# EAGLE design 214_oled 1_0_11 (EAGLE 9.6.0)
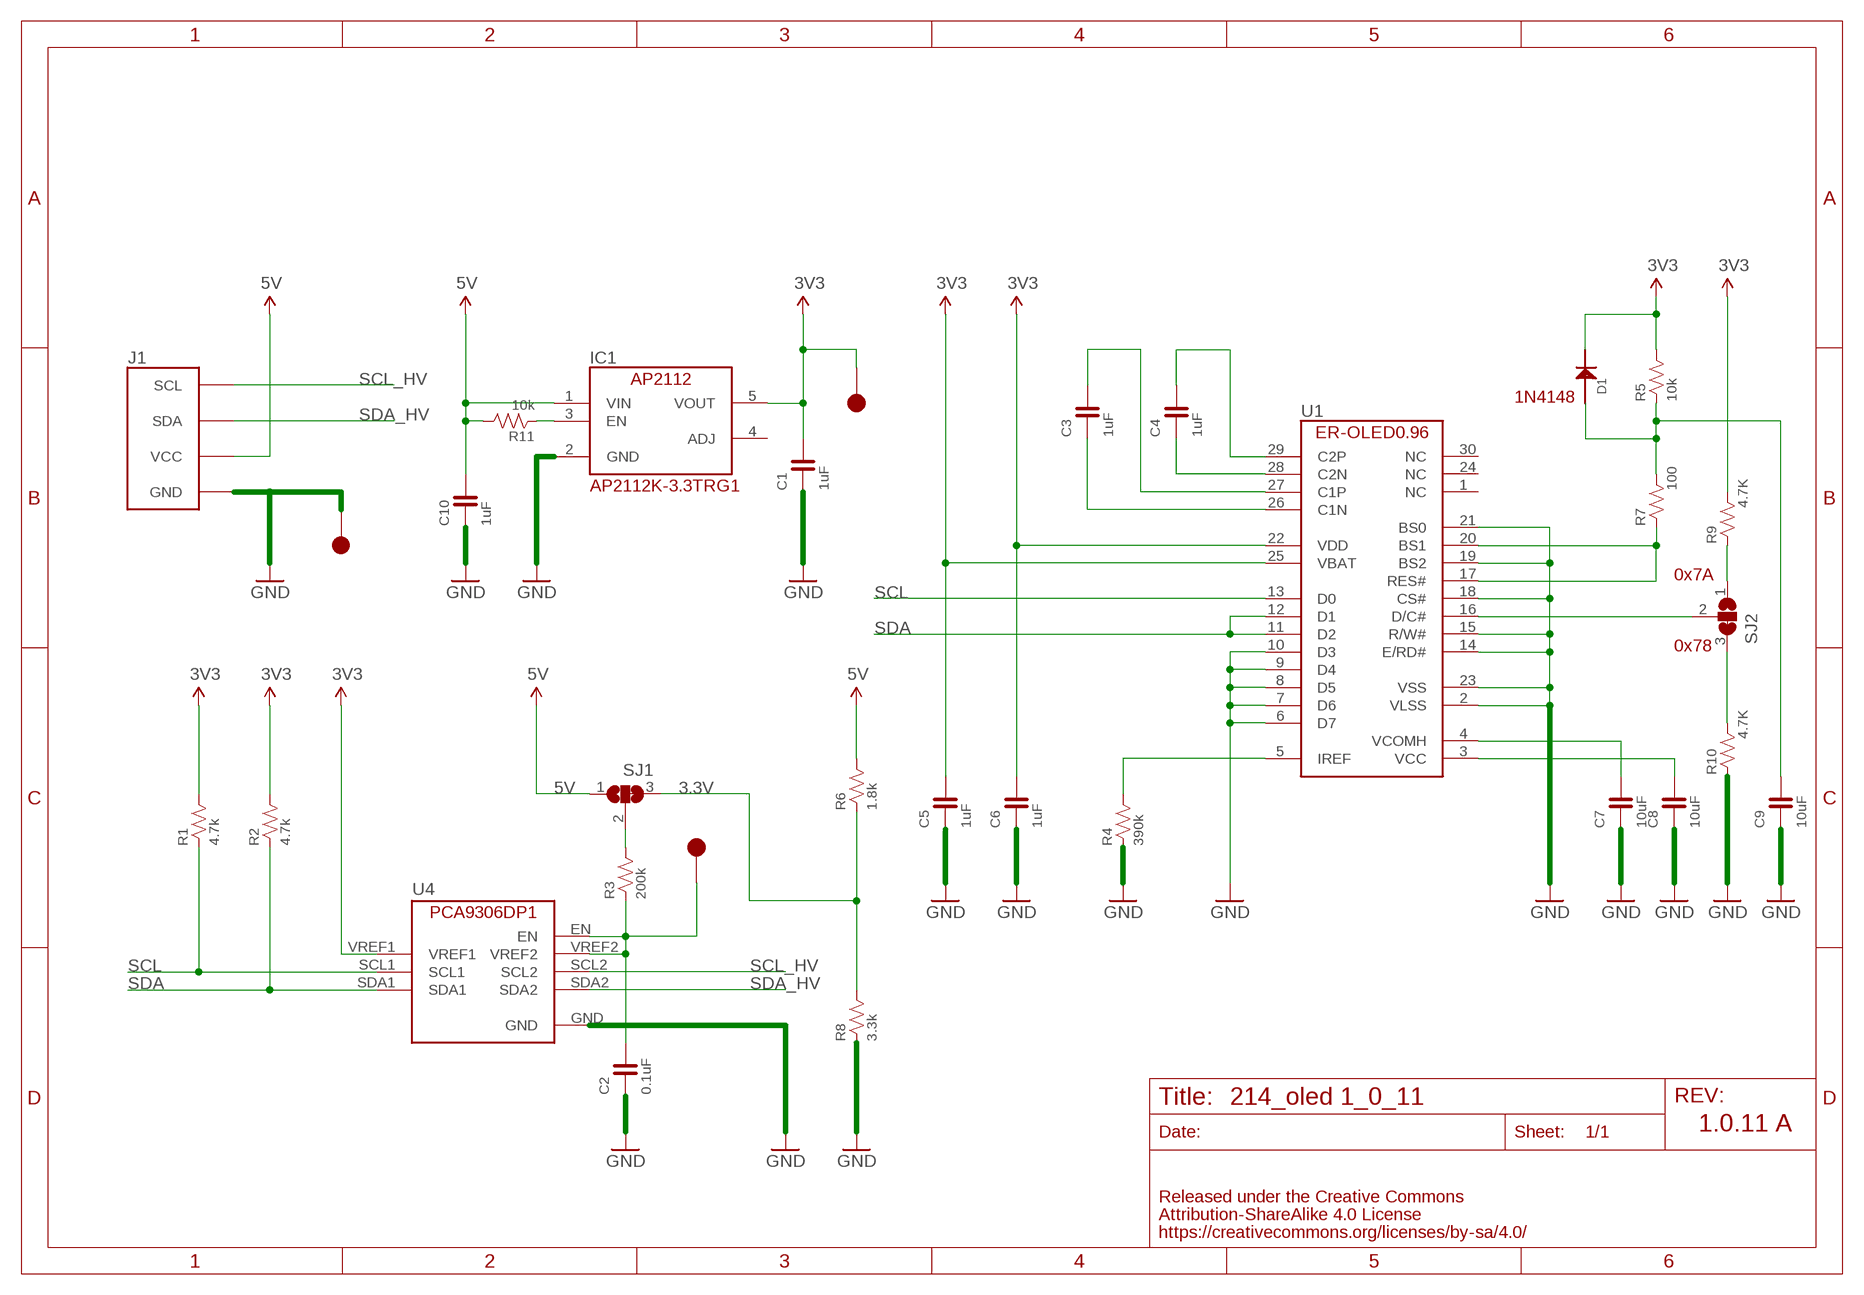
[diagram p0: schematic, sheet 1]

## Parts
C1  1uF  CAPACITOR-0603  [0603]
C2  0.1uF  CAPACITOR-0603  [0603]
C3  1uF  CAPACITOR-0603  [0603]
C4  1uF  CAPACITOR-0603  [0603]
C5  1uF  CAPACITOR-0603  [0603]
C6  1uF  CAPACITOR-0603  [0603]
C7  10uF  CAPACITOR-0603  [0603]
C8  10uF  CAPACITOR-0603  [0603]
C9  10uF  CAPACITOR-0603  [0603]
C10  1uF  CAPACITOR-0603  [0603]
D1  1N4148  [1N4148W]
IC1  AP2112K-3.3TRG1  [SOT-23-5]
J1  FABO_BRICK_I2C-OLED  [FABO_BRICK_I2C_OLED]
R1  4.7k  RESISTOR-0603  [0603]
R2  4.7k  RESISTOR-0603  [0603]
R3  200k  RESISTOR-0603  [0603]
R4  390k  RESISTOR-0603  [0603]
R5  10k  RESISTOR-0603  [0603]
R6  1.8k  RESISTOR-0603  [0603]
R7  100  RESISTOR-0603  [0603]
R8  3.3k  RESISTOR-0603  [0603]
R9  4.7K  RESISTOR-0603  [0603]
R10  4.7K  RESISTOR-0603  [0603]
R11  10k  RESISTOR-0603  [0603]
SJ1  SJ2W  [SJ_2]
SJ2  SJ2W  [SJ_2]
TP1  TP-15  [TP-15]
TP2  TP-15  [TP-15]
TP5  TP-15  [TP-15]
U1  ER-OLED0.96-1ER-CON30HT-1  [ER-CON30HT-1]
U4  PCA9306DP1  [TSSOP8]

## Nets
3.3V: R6.1 R8.2 SJ1.3
3V3: C1.2 C5.2 C6.2 D1.CATHODE IC1.5(VOUT) R1.2 R2.2 R5.2 R9.2 TP5.1 U1.22(VDD) U1.25(VBAT) U4.VREF1
5V: C10.2 IC1.1(VIN) J1.VCC R6.2 R11.2 SJ1.1
GND: C1.1 C2.1 C5.1 C6.1 C7.1 C8.1 C9.1 C10.1 IC1.2(GND) J1.GND R4.1 R8.1 R10.1 TP1.1 U1.2(VLSS) U1.6(D7) U1.7(D6) U1.8(D5) U1.9(D4) U1.10(D3) U1.14(E/RD#) U1.15(R/W#) U1.18(CS#) U1.19(BS2) U1.21(BS0) U1.23(VSS) U4.GND
N$1: C3.2 U1.27(C1P)
N$2: C3.1 U1.26(C1N)
N$3: C4.1 U1.28(C2N)
N$4: C4.2 U1.29(C2P)
N$5: R4.2 U1.5(IREF)
N$6: C7.2 U1.4(VCOMH)
N$7: C8.2 U1.3(VCC)
N$8: C2.2 R3.1 TP2.1 U4.EN U4.VREF2
N$9: R3.2 SJ1.2
N$10: R7.1 U1.17(RES#) U1.20(BS1)
N$11: IC1.3(EN) R11.1
N$12: C9.2 D1.ANODE R5.1 R7.2
N$13: SJ2.2 U1.16(D/C#)
N$14: R10.2 SJ2.3
N$15: R9.1 SJ2.1
SCL: R1.1 U1.13(D0) U4.SCL1
SCL_HV: J1.SCL U4.SCL2
SDA: R2.1 U1.11(D2) U1.12(D1) U4.SDA1
SDA_HV: J1.SDA U4.SDA2
Unconnected: IC1.4(ADJ) U1.1(NC) U1.24(NC) U1.30(NC)

## Notes on the sheet
- 1N4148
- AP2112K-3.3TRG1
- 0x7A
- 0x78
- 1.0.11 A

## Library data of the parts
C1-C10 = FaBo-Capacitor:CAPACITOR: CAPACITOR
D1 = FaBo-Diode:1N4148
IC1 = FaBo-Supply:AP2112
J1 = FaBo-Template:FABO_BRICK_I2C: FaBo Brick I2C
R1-R11 = FaBo-Resistors:RESISTOR: RESISTOR
SJ1 SJ2 = jumper:SJ2W: SMD solder JUMPER
TP1 TP2 TP5 = FaBo-Supply:TP
U1 = FaBo-Display:ER-OLED0.96-1
U4 = FaBo-LevelTranslator:PCA9306DP1

## Board
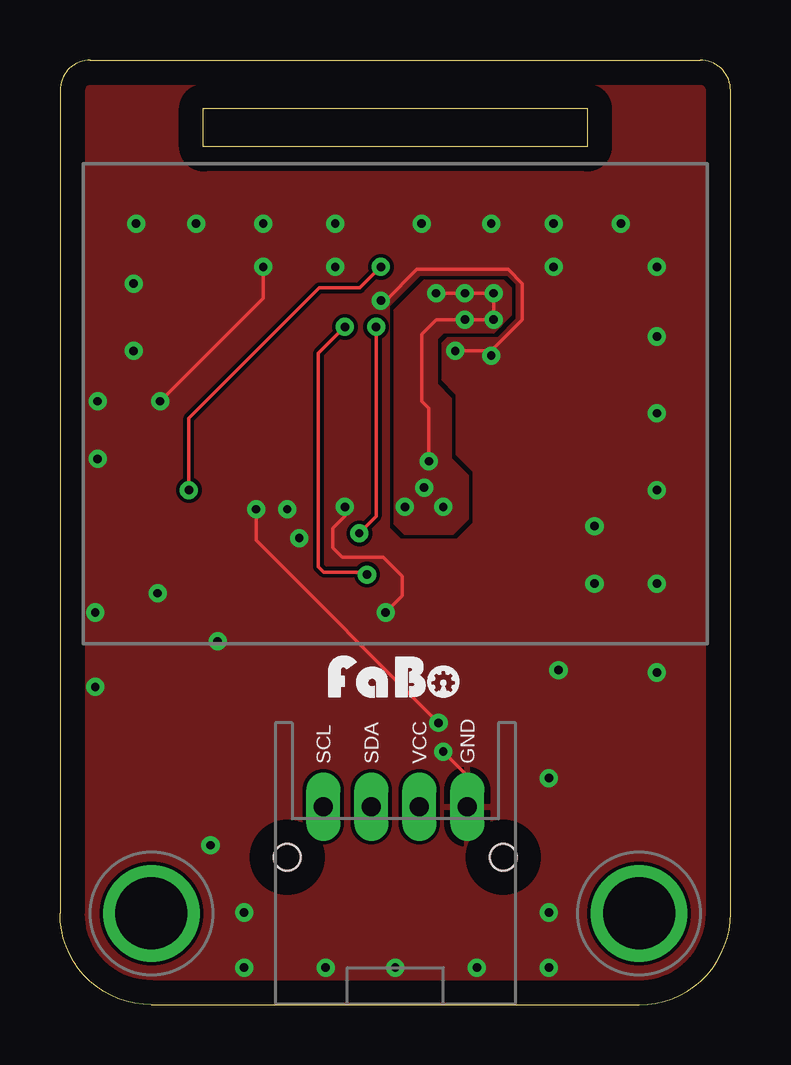
[diagram p1: board, top side]
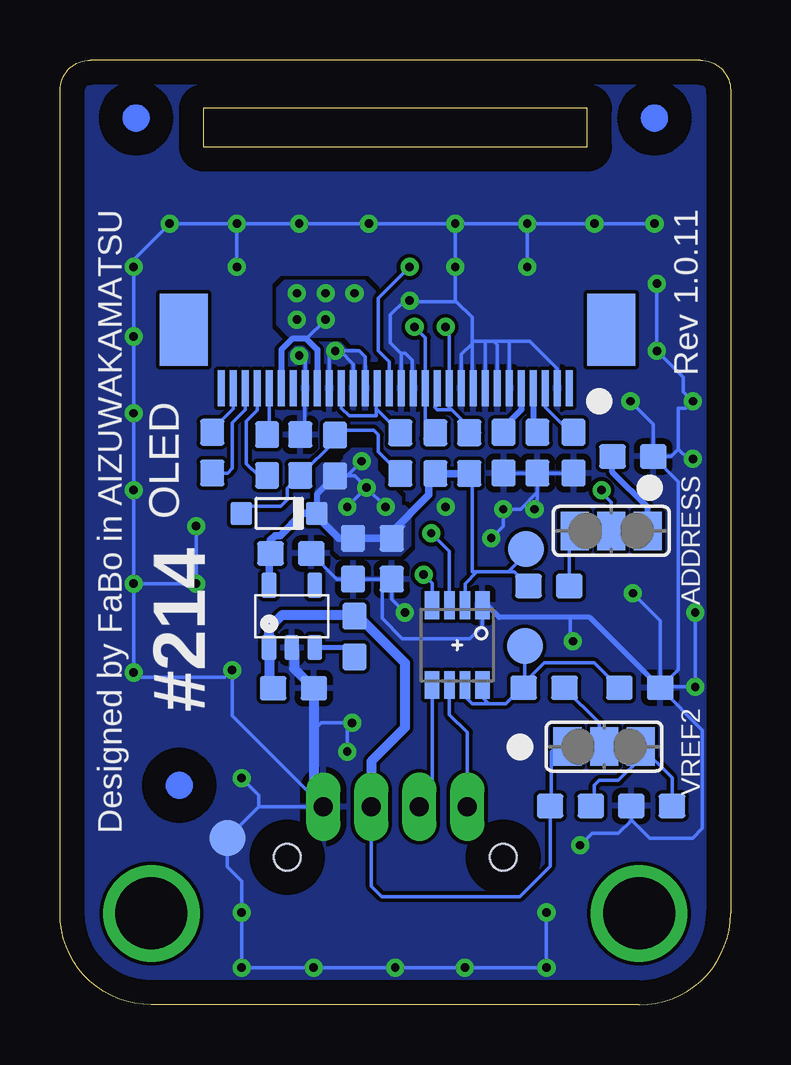
[diagram p2: board, bottom side, seen from below]

Size 27.94 x 39.37 mm. Coordinates in mm from the lower left corner, seen from the top.
Outline: 5.97,37.35 21.97,37.35 21.97,35.75 5.97,35.75 5.97,37.35
Copper layers (1*16): Top 0.035mm / dielectric 1.5mm / Bottom 0.035mm
Design rules "default *": minimum track width 6mil, minimum drill 0.35mm, track to track 6mil, track to pad 6mil, pad to pad 6mil, via to via 6mil, smd to smd 6mil, copper to edge 40mil, drill to drill 6mil, minimum pad ring 10mil, minimum via ring 8mil, stop-mask expansion 4mil, vias tented up to drill 0.4mm, thermal gap 10mil
bRestrict: area 9.4,24.9 to 9.6,26.4; area 9.9,24.9 to 10.1,26.4; area 10.4,24.9 to 10.6,26.4; area 10.9,24.9 to 11.1,26.4; area 13.4,24.9 to 13.6,26.4; area 15.4,24.9 to 15.6,26.4

### Footprints (pad centres in the part's own frame; a part is rotated, then mirrored left to right if it is on the bottom)
0603 = smd 1.1 x 1: 1 -0.85,0; 2 0.85,0
1N4148W = smd 0.9 x 0.95: ANODE 0,0; CATHODE 3.15,0
SOT-23-5 = smd 0.6 x 1.05: 1 -0.95,-1.3; 2 0,-1.3; 3 0.95,-1.3; 4 0.95,1.3; 5 -0.95,1.3
FABO_BRICK_I2C_OLED = drill 0.8 pad 1.422 long: GND 3,-10.795; SCL -3,-10.795; SDA -1,-10.795; VCC 1,-10.795 | drill 3 pad 3.81: P$1 -10.16,-15.24; P$2 10.16,-15.24 | hole 1.1: -4.5,-12.895; 4.5,-12.895
SJ_2 = smd 1.168 x 1.6: 1 -1.524,0; 2 0,0; 3 1.524,0
TP-15 = smd 1.5 x 1.5: 1 0,0
ER-CON30HT-1 = smd 0.3 x 1.5 bottom: 1 7,-0.23; 2 6.5,-0.23; 3 6,-0.23; 4 5.5,-0.23; 5 5,-0.23; 6 4.5,-0.23; 7 4,-0.23; 8 3.5,-0.23; 9 3,-0.23; 10 2.5,-0.23; 11 2,-0.23; 12 1.5,-0.23; 13 1,-0.23; 14 0.5,-0.23; 15 0,-0.23; 16 -0.5,-0.23; 17 -1,-0.23; 18 -1.5,-0.23; 19 -2,-0.23; 20 -2.5,-0.23; 21 -3,-0.23; 22 -3.5,-0.23; 23 -4,-0.23; 24 -4.5,-0.23; 25 -5,-0.23; 26 -5.5,-0.23; 27 -6,-0.23; 28 -6.5,-0.23; 29 -7,-0.23; 30 -7.5,-0.23 | smd 2 x 3 bottom: 31 -9.07,-2.67; 32 8.74,-2.67
TSSOP8 = smd 0.6 x 1.15: EN -1.05,1.663; GND -1.05,-1.663; SDA1 1.05,-1.663; SDA2 1.05,1.663 | smd 0.45 x 1.15: SCL1 0.325,-1.663; SCL2 0.325,1.663; VREF1 -0.325,-1.663; VREF2 -0.325,1.663

### Placement (x,y rotation side)
C1  18.32,18.81 180 bottom
C2  3.78,13.21 180 bottom
C3  19.31,22.91 270 bottom
C4  21.6,23.01 90 bottom
C5  15.73,18.59 90 bottom
C6  14.12,18.59 90 bottom
C7  8.05,23.01 90 bottom
C8  6.54,23.01 90 bottom
C9  17.93,22.91 270 bottom
C10  18.21,13.19 180 bottom
D1  20.39,20.48 0 bottom
IC1  18.28,16.19 0 bottom
J1  13.97,19.05 0 top
R1  12.3,22.99 270 bottom
R2  10.89,22.99 270 bottom
R3  7.77,13.21 0 bottom
R4  9.46,23.01 90 bottom
R5  16.48,22.89 270 bottom
R6  6.67,8.29 180 bottom
R7  13.76,22.99 270 bottom
R8  3.29,8.29 0 bottom
R9  7.57,17.45 180 bottom
R10  4.07,22.85 180 bottom
R11  15.67,15.35 90 bottom
SJ1  5.27,10.76 0 bottom
SJ2  4.97,19.75 0 bottom
TP1  20.97,6.95 0 bottom
TP2  8.57,14.95 0 bottom
TP5  8.52,19 0 bottom
U1  13.72,25.47 180 top
U4  11.39,14.99 180 bottom
U$3  [MARK_POINT_3MM]  24.77,36.95 0 bottom
U$4  [MARK_POINT_3MM]  22.97,9.15 0 bottom
U$5  [MARK_POINT_3MM]  3.17,36.95 0 bottom
U$6  [LOGO_FABO_S]  13.97,12.65 0 top

### Tracks (layer width: path | path; a pad name or v marks a point on that pad's centre or on a via)
3.3V
  Bottom 0.152: R6.1 5.67,8.44 5.67,9.15 5.47,9.35 4.67,9.35 3.75,10.27 SJ1.3 2.44,9.45 R8.2
3V3  (via drill 0.35)
  Top 0.152: v15.37,22.65 15.37,24.85 15.07,25.15 15.07,27.95 15.67,28.55 v16.87,28.55 v18.07,28.55 v18.07,29.65 v16.87,29.65 v15.67,29.65
  Bottom 0.152: 17.18,20.55 17.18,20.48 D1.CATHODE 17.64,20.48 | U4.VREF1 11.07,17.55 10.57,18.05 | R9.2 9.02,18.05 9.27,18.05 | 10.57,18.05 10.77,18.05 10.77,22.02 R2.2 | 10.57,18.05 9.27,18.05 | 13.62,19.94 C6.2 | 19.17,18.95 C1.2 | IC1.5 19.17,17.55 | 9.27,18.05 8.52,18.8 TP5.1 | v15.17,21.55 15.66,22.04 R5.2 15.98,22.04 v15.37,22.65 | v16.87,28.55 17.67,27.75 | v14.37,20.75 v15.17,21.55 | v15.17,21.55 v15.97,20.75
  Bottom 0.254: R1.2 12.52,22.14 | C5.2 | R5.2 17.24,21.28 D1.CATHODE | U1.22 17.22,27.3 17.67,27.75 18.27,27.75 18.72,27.3 U1.25
  Bottom 0.305: IC1.5 19.23,18.75 C1.2 19.17,19.35 18.97,19.55 18.77,19.55 17.84,20.48 D1.CATHODE 17.24,20.35 16.33,19.44 C5.2 C6.2 14.12,19.7 12.57,21.25 12.57,21.87 R1.2 R2.2
  pour Top (no thermals): 13.97,28.95 13.97,20.05 14.37,19.65 16.37,19.65 16.97,20.25 16.97,22.05 16.27,22.75 16.27,25.25 15.67,25.85 15.67,27.75 15.97,28.05 18.07,28.05 18.77,28.75 18.77,29.85 18.47,30.15 15.17,30.15
  pour Bottom (no thermals): 14.17,27.45 14.17,29.05 15.27,30.15 18.57,30.15 18.87,29.85 18.87,28.35 18.47,27.95 18.37,27.85 16.07,27.85 15.67,27.45 15.67,27.25 15.27,26.85 14.77,26.85
  pour Bottom (no thermals): 13.77,20.75 13.77,21.15 14.47,21.85 14.47,21.95 14.77,22.25 14.77,22.95 14.97,23.15 15.77,23.15 16.07,22.85 16.07,22.75 16.27,22.55 17.07,22.55 17.27,22.35 17.27,21.75 17.27,20.45 16.47,19.65 16.47,18.95 16.27,18.75 15.77,18.75 13.77,18.75 13.47,19.05 13.37,19.15 13.37,20.55 13.57,20.75
5V
  Bottom 0.152: J1.VCC 14.97,4.95 14.53,4.51 8.79,4.51 7.52,5.78 R6.2 7.47,8.34 7.47,10.55 7.26,10.76 SJ1.1
  Bottom 0.406: C10.2 19.26,13.39 19.26,13.62 19.23,13.65 IC1.1 19.23,15.69 18.67,16.25 15.72,16.25 R11.2 15.52,16.2 13.57,14.25 13.57,11.55 14.97,10.15 J1.VCC
GND  (via drill 0.35)
  Top 0.152: v4.17,25.15 8.47,29.45 v8.47,30.75 | v8.17,20.65 8.17,19.35 v15.77,11.75 | v15.97,10.55 16.97,9.55 J1.GND | v17.97,27.05 17.87,27.15 | 17.87,27.15 17.77,27.25 v16.47,27.25 | v13.37,29.34 13.56,29.34 14.87,30.65 18.67,30.65 19.27,30.05 19.27,28.55 17.87,27.15 | v11.87,20.75 11.87,20.35 11.37,19.85 11.37,19.05 11.77,18.65 13.47,18.65 14.27,17.85 14.27,17.05 v13.57,16.35
  Bottom 0.152: C2.1 1.17,11.45 1.17,7.35 1.57,6.95 3.37,6.95 4.14,7.72 | 4.14,7.72 R8.1 | R10.1 3.22,24.2 v4.17,25.15 | 10.34,16.85 U4.GND 10.34,15.78 10.87,15.25 13.67,15.25 14.52,16.1 14.52,17.34 C6.1 | R10.1 2.17,21.8 2.17,13.97 C2.1 | C2.1 2.93,16.01 v4.07,17.15 | v11.47,32.55 v11.47,30.75 11.47,29.35 11.42,29.3 | v11.47,32.55 v15.07,32.55 v17.97,32.55 v20.57,32.55 | v20.57,32.55 v20.57,30.75 | 11.42,29.3 10.77,28.65 10.77,27.65 | v8.47,32.55 v11.47,32.55 | v8.47,32.55 v8.47,30.75 | v8.47,32.55 v5.67,32.55 v3.17,32.55 | v20.57,32.55 v23.37,32.55 24.87,31.05 v24.87,30.75 v24.87,27.85 v24.87,24.65 v24.87,21.45 v24.87,17.55 24.87,17.45 | 24.87,17.45 v24.87,13.85 24.67,13.65 21.07,13.65 v20.77,13.95 20.77,12.06 J1.GND 19.66,8.26 | 19.66,8.26 TP1.1 20.97,5.75 20.37,5.15 v20.37,3.85 v20.37,1.55 v17.37,1.55 v13.97,1.55 v11.07,1.55 v7.67,1.55 v7.67,3.85 | C2.1 2.89,13.25 v1.47,13.25 v1.47,16.35 | 2.17,23.15 2.17,24.85 1.87,24.85 v1.57,25.15 1.97,25.55 1.97,26.15 v3.07,27.25 v3.07,30.05 | 2.17,23.15 2.47,22.85 R10.1 | v1.57,22.75 1.77,22.75 2.17,23.15 | v20.37,9.45 19.66,8.75 19.66,8.26 | v6.57,15.15 6.67,15.25 6.67,16.15 | v6.27,6.65 5.77,7.15 4.67,7.15 4.14,7.68 4.14,7.72 | C9.1 17.74,23.95 17.74,25.68 | C6.1 C5.1 16.4,17.74 C1.1 | C8.1 C7.1 | C7.1 R4.1 | C7.1 8.05,21.35 | 8.05,21.35 8.05,20.77 v8.17,20.65 | 17.36,11.45 17.06,11.75 v15.77,11.75 15.97,11.55 v15.97,10.55 | U1.9 10.77,25.75 10.77,27.55 | 10.77,27.65 10.77,27.55 | U1.2 7.22,26.5 8.37,27.65 9.27,27.65 | 9.27,27.65 9.87,27.65 | 9.87,27.65 10.27,27.65 | 10.27,27.65 10.77,27.65 | U1.6 9.22,27.6 9.27,27.65 | U1.7 9.72,27.5 9.87,27.65 | U1.8 10.22,27.6 10.27,27.65
  Bottom 0.152: U1.23 17.72,26.8 v17.97,27.05 | U1.21 16.72,27 v16.47,27.25 16.27,27.25 | U1.19 15.72,26.7 16.27,27.25 | 11.42,29.3 13.22,29.3 | U1.14 13.27,25.75 13.27,26.85 13.56,27.14 13.73,27.14 | v13.37,29.34 13.58,29.34 14.17,28.75 14.17,27.58 13.73,27.14 | U1.10 11.22,27.1 10.77,27.55 | U1.15 13.72,27.13 13.73,27.14 | U1.18 15.22,27 15.47,27.25 16.27,27.25 | v9.97,19.45 9.47,19.95 v9.47,20.65 8.75,20.65 8.05,21.35 | C6.1 14.12,16.9 v13.57,16.35 | v22.27,19.95 v22.27,17.55 24.77,17.55 24.87,17.45
  Bottom 0.2: C2.1 5.87,16.15 6.67,16.15 9.64,16.15 10.34,16.85
  Bottom 0.254: 17.74,25.68 U1.23 | 17.93,23.89 C9.1
  Bottom 0.406: J1.GND 17.36,8.65 17.36,11.45 C10.1 18.18,14.01 18.18,14.79 IC1.2
  pour Bottom (rank 6): 1.07,38.95 26.37,38.95 27.47,37.85 27.47,2.95 24.77,0.25 3.27,0.25 0.37,3.15 0.37,38.25
  pour Top (rank 6): 0.37,38.25 1.07,38.95 26.47,38.95 27.57,37.85 27.57,3.05 24.77,0.25 3.27,0.25 0.37,3.15
N$1
  Bottom 0.152: U1.27 19.72,24.77 20.17,24.32 20.17,22.55 19.68,22.06 C3.2
N$2
  Bottom 0.152: U1.26 19.22,23.85 C3.1
N$3
  Bottom 0.152: U1.28 20.22,24.8 20.77,24.25 20.77,22.35 20.96,22.16 C4.1
N$4
  Bottom 0.152: 21.82,24.08 C4.2 21.6,23.95 | 21.6,23.95 21.6,24.02 | U1.29 20.72,24.83 21.6,23.95
N$5
  Bottom 0.254: U1.5 8.72,24.8 9.46,24.06 R4.2
N$6
  Bottom 0.152: C7.2 8.11,23.91
  Bottom 0.254: U1.4 8.22,24.03 8.11,23.91
N$7
  Bottom 0.152: C8.2 6.68,23.86 7.72,24.9 U1.3
N$8
  Bottom 0.152: 10.07,12.55 9.37,12.55 8.71,13.21 R3.1 8.62,13.4 8.57,13.45 | U4.EN 10.34,12.82 10.07,12.55 | C2.2 5.67,14.25 7.77,14.25 8.57,13.45 | U4.VREF2 11.07,12.85 10.77,12.55 10.07,12.55 | TP2.1 8.57,13.45
N$9
  Bottom 0.152: SJ1.2 5.47,10.96 5.47,11.75 R3.2
N$10
  Bottom 0.152: U1.17 14.76,25.66 14.76,24.84 | 13.76,23.86 R7.1 14.76,24.84 | 14.76,24.84 14.76,24.54 15.89,24.54 16.22,24.87 U1.20
N$11
  Bottom 0.203: R11.1 16.06,14.89 IC1.3
N$12
  Bottom 0.152: R5.1 16.5,23.76 | R5.1 16.48,23.51 C9.2 18.47,21.52 18.47,21.05 18.74,20.78 20.09,20.78 D1.ANODE | 14.07,22.45 R7.2 14.67,23.05 14.67,23.75 14.87,23.95 16.27,23.95 R5.1
N$13  (via drill 0.35)
  Top 0.152: v13.37,30.75 12.5,29.88 10.79,29.88 5.37,24.45 v5.37,21.45
  Bottom 0.152: SJ2.2 4.97,20.95 5.37,21.35 v5.37,21.45 | U1.16 14.22,26.8 14.67,27.25 14.67,29.45 v13.37,30.75
N$14
  Bottom 0.254: SJ2.3 3.45,20.73 4.92,22.2 R10.2
N$15
  Bottom 0.152: SJ2.1 6.72,19.52 R9.1
SCL  (via drill 0.35)
  Top 0.152: v12.47,19.65 13.17,20.35 v13.17,28.25
  Bottom 0.152: 12.53,23.81 12.58,23.76 | 12.58,23.76 12.75,23.59 | 12.3,24.19 R1.1 12.43,23.71 12.53,23.81 | U4.SCL1 11.71,18.89 v12.47,19.65 | 12.72,23.9 12.58,23.76 | v13.17,28.25 12.72,27.8 U1.13 12.72,24 12.53,23.81
SCL_HV
  Bottom 0.152: J1.SCL 10.97,11.35 11.71,12.1 U4.SCL2
SDA  (via drill 0.35)
  Top 0.152: v11.87,28.25 10.77,27.15 10.77,18.25 10.99,18.03 12.69,18.03 v12.79,17.93
  Bottom 0.152: 10.46,23.84 R2.1 10.89,24.07 11.62,24.8 | 11.62,24.8 11.77,24.95 11.77,25.65 U1.11 11.72,28.1 v11.87,28.25 | U1.12 12.22,24.99 12.32,24.9 12.22,24.8 11.62,24.8 | 12.47,16.68 U4.SDA1 12.44,17.58 v12.79,17.93
SDA_HV
  Bottom 0.152: 12.44,12.78 U4.SDA2 12.44,8.79 J1.SDA

### Text on the board
bPlace: Rev 1.0.11 | Designed by FaBo in AIZUWAKAMATSU | ADDRESS | OLED | #214 | VREF2